# EAGLE design BreadBoard-Power-Supply_v10 (EAGLE 7.5.0)
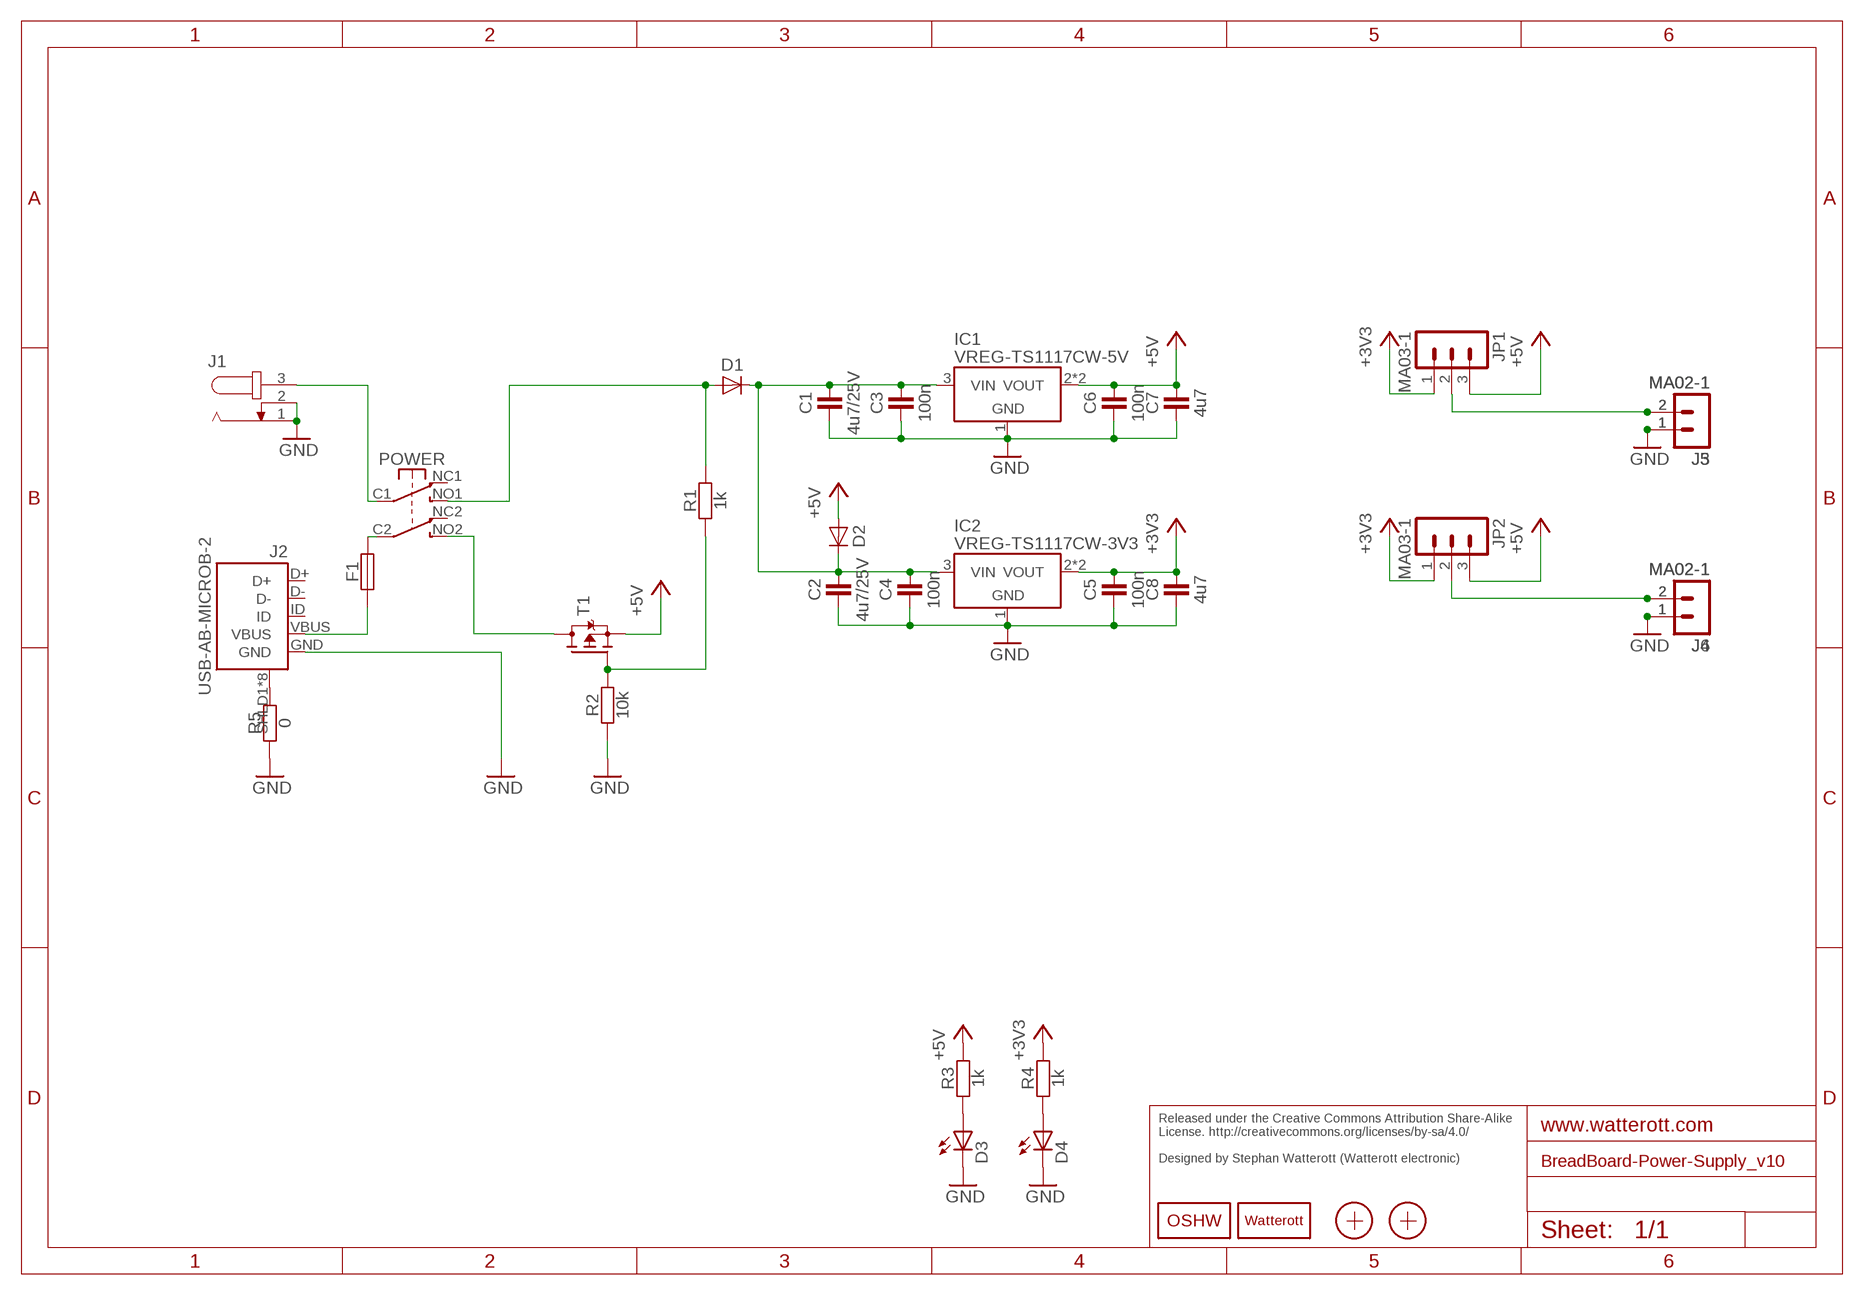
[diagram p0: schematic, sheet 1]

## Parts
C1  4u7/25V  CAPACITOR-1206  [C1206]
C2  4u7/25V  CAPACITOR-1206  [C1206]
C3  100n  CAPACITOR-0402  [C0402]
C4  100n  CAPACITOR-0402  [C0402]
C5  100n  CAPACITOR-0402  [C0402]
C6  100n  CAPACITOR-0402  [C0402]
C7  4u7  CAPACITOR-0402  [C0402]
C8  4u7  CAPACITOR-0402  [C0402]
D1  DIODE-SOD80  [SOD80]
D2  DIODE-SOD80  [SOD80]
D3  LED-0603  [C0603]
D4  LED-0603  [C0603]
F1  FUSE-0805  [C0805]
IC1  VREG-TS1117CW-5V  [SOT223]
IC2  VREG-TS1117CW-3V3  [SOT223]
J1  DC-JACK-2.1  [DC-JACK]
J2  USB-AB-MICROB-2  [USB-MICROB-10118194]
J3  MA02-1  [MA02-1]
J4  MA02-1  [MA02-1]
J5  MA02-1  [MA02-1]
J6  MA02-1  [MA02-1]
JP1  MA03-1  [MA03-1]
JP2  MA03-1  [MA03-1]
LOGO1  OSHW_LOGOX0070  [OSHW_6X70]
LOGO2  LOGO-PLACE  [LOGO_TPLACE]
POWER  SW-2UMGF1260159  [GF1260159]
R1  1k  RESISTOR-0402  [C0402]
R2  10k  RESISTOR-0402  [C0402]
R3  1k  RESISTOR-0402  [C0402]
R4  1k  RESISTOR-0402  [C0402]
R5  0  RESISTOR-0402  [C0402]
T1  MOSFET-P-SOT23  [SOT23]
X1  PASSER-07  [PASSER_07MM]
X2  PASSER-07  [PASSER_07MM]

## Nets
+3V3: C5.2 C8.2 IC2.2(VOUT) IC2.4(VOUT) JP1.1 JP2.1 R4.2
+5V: C6.2 C7.2 D2.A IC1.2(VOUT) IC1.4(VOUT) JP1.3 JP2.3 R3.2 T1.2(S)
GND: C1.1 C2.1 C3.1 C4.1 C5.1 C6.1 C7.1 C8.1 D3.C D4.C IC1.1(GND) IC2.1(GND) J1.1 J1.2 J2.GND J3.1 J4.1 J5.1 J6.1 R2.1 R5.1
N$1: D1.A POWER.NO1(S1) R1.2
N$2: J1.3 POWER.C1(P1)
N$4: R1.1 R2.2 T1.1(G)
N$6: POWER.NO2(S2) T1.3(D)
N$8: D3.A R3.1
N$9: D4.A R4.1
N$10: J3.2 J5.2 JP1.2
N$11: J4.2 J6.2 JP2.2
N$12: F1.2 POWER.C2(P2)
N$15: J2.SHLD1(SHIELD) J2.SHLD2(SHIELD) J2.SHLD3(SHIELD) J2.SHLD4(SHIELD) J2.SHLD5(SHIELD) J2.SHLD6(SHIELD) J2.SHLD7(SHIELD) J2.SHLD8(SHIELD) R5.2
VBUS: F1.1 J2.VBUS
VIN: C1.2 C2.2 C3.2 C4.2 D1.C D2.C IC1.3(VIN) IC2.3(VIN)
Unconnected: J2.D+ J2.D- J2.ID POWER.NC1(O1) POWER.NC2(O2)

## Notes on the sheet
- Released under the Creative Commons Attribution Share-Alike 
  License. http://creativecommons.org/licenses/by-sa/4.0/
  
  Designed by Stephan Watterott (Watterott electronic)

## Library data of the parts
C1-C8 = we-rcl:CAPACITOR: Capacitors ...4.7uF @ 6.3V -> 0402 ...10uF @ 16V -> 0603 ...22uF @ 25V -> 0805
D1 D2 = we-rcl:DIODE: Diodes
D3 D4 = we-opto:LED: LEDs red, green, blue -> 0603
F1 = we-rcl:FUSE: Fuses
IC1 IC2 = we-power:VREG: Voltage Regulators (LDOs, Switching Converters...) LDOs Taiwan Semi TS1117 800mA max 15V - compatible On Semi NCP1117 1A max 20V Taiwan Semi TS9011 250mA max 12V - compatible Diodes AP2210 300mA max 15V Taiwan Semi TS5204 150mA max 16V DC/DC Converter Modules Recom R-78Ex.x-1.0-W36 1A max 28V Murata OKI-78SR-x.x/1.5-W36 1.5A max 36V
J1 = we-con:DC-JACK: DC Jack (2.1mm and 2.5mm)
J2 = we-con:USB-AB: USB Connectors with ID-Pin (5 Pins)
J3-J6 = we-con:MA02-1
JP1 JP2 = we-con:MA03-1: Pin Header
LOGO1 = we-symbol:OSHW_LOGO: Open-Source-Hardware Logo
LOGO2 = we-symbol:LOGO: Watterott electronic Logo
POWER = we-switch:SW-2UM: Switch
R1-R5 = we-rcl:RESISTOR: Resistors all kinds in 0603 and 0402
T1 = we-transistor:MOSFET-P: P-Channel MOSFET (e.g. IRLML6402)
X1 X2 = we-symbol:PASSER: Fiducial Markers

## Board
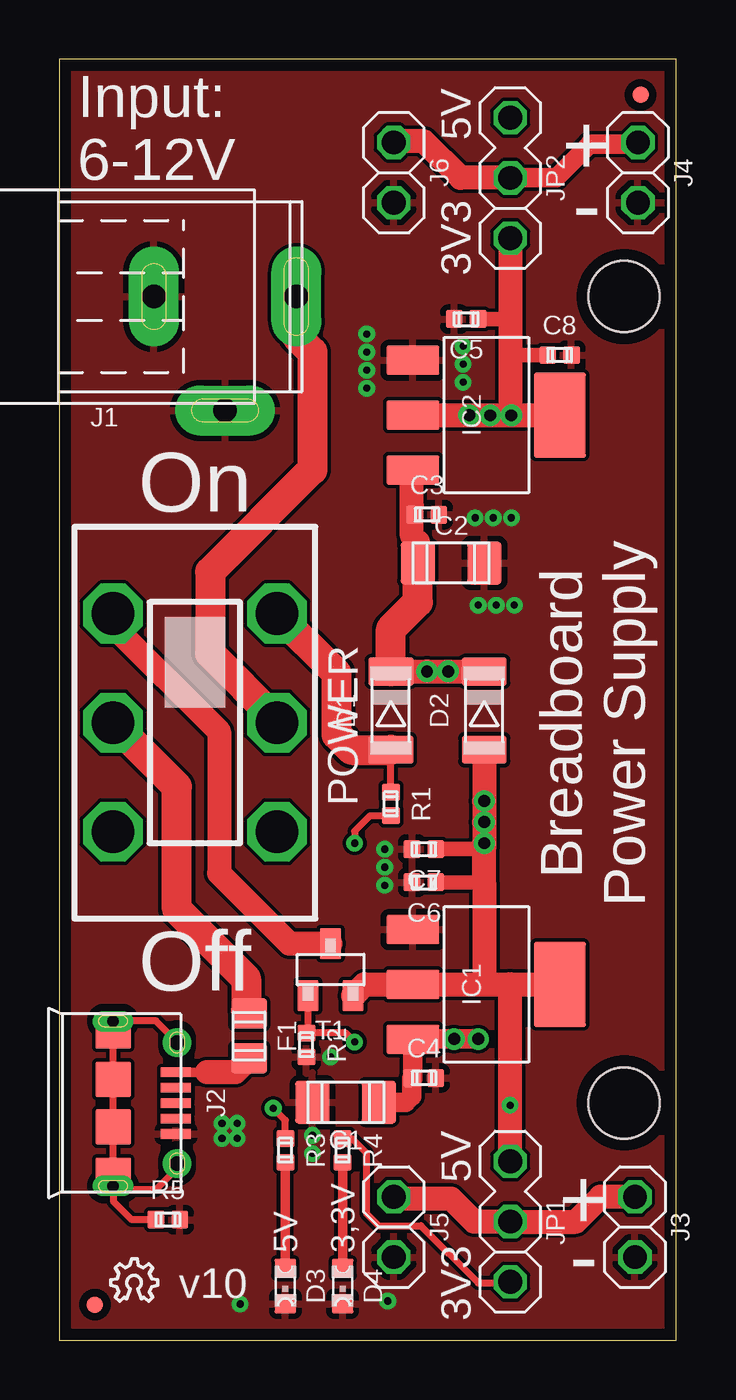
[diagram p1: board, top side]
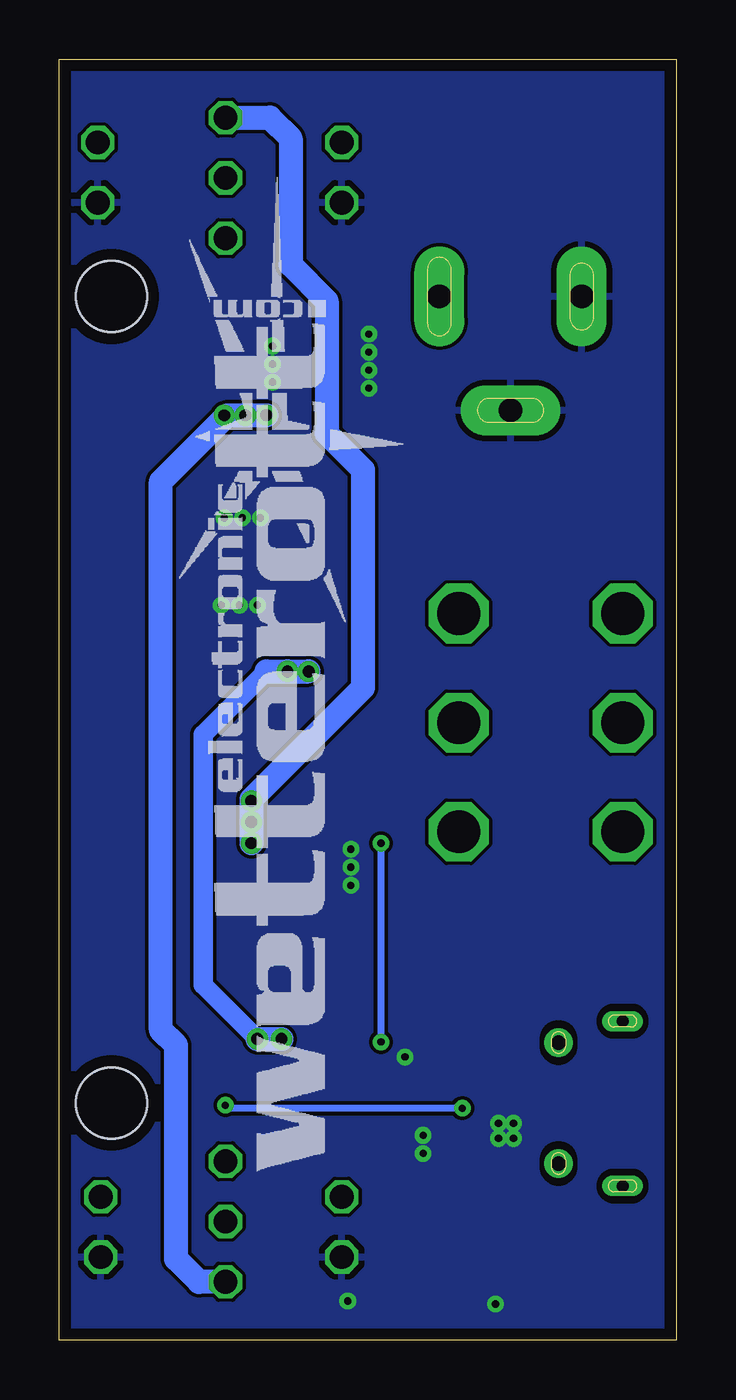
[diagram p2: board, bottom side, seen from below]

Size 26 x 54 mm. Coordinates in mm from the lower left corner, seen from the top.
Outline: 0,0 26,0 26,54 0,54 0,0
Copper layers (1*16): Top 0.035mm / dielectric 1.5mm / Bottom 0.035mm
Design rules "we-dru-2-layer": minimum track width 0.15mm, minimum drill 0.3mm, track to track 0.15mm, track to pad 0.15mm, pad to pad 0.15mm, via to via 0.15mm, smd to smd 0.1mm, copper to edge 0.5mm, drill to drill 0.2mm, minimum pad ring 0.18mm, minimum via ring 0.2mm, stop-mask expansion 0.1mm, vias tented up to drill 0.5mm, thermal gap 0.25mm
Holes 3 mm at 23.8,44 23.8,10

### Footprints (pad centres in the part's own frame; a part is rotated, then mirrored left to right if it is on the bottom)
C1206 = smd 1.8 x 1.45: 1 0,1.4; 2 0,-1.4
C0402 = smd 0.75 x 0.7: 1 0,0.5; 2 0,-0.5
SOD80 = smd 1.9 x 1.2: A 0,-1.65; C 0,1.65
C0603 = smd 0.9 x 0.8: A 0,-0.75; C 0,0.75
C0805 = smd 1.5 x 1.25: 1 0,0.95; 2 0,-0.95
SOT223 = smd 2.235 x 1.219: 1 -3.099,2.311; 2 -3.099,0; 3 -3.099,-2.311 | smd 2.2 x 3.6: 4 3.099,0
DC-JACK = drill 1 pad 2.1 long: 1 3,0; 2 0,4.8; 3 -3,0
USB-MICROB-10118194 = smd 1.3 x 0.4: D+ -2.5,0; D- -2.5,-0.65; GND -2.5,1.3; ID -2.5,0.65; VBUS -2.5,-1.3 | drill 0.6 pad 1.2: SHLD1 -2.55,2.55; SHLD2 -2.55,-2.55 | drill 0.5 pad 0.8 long: SHLD3 0.15,3.5; SHLD4 0.15,-3.45 | smd 1.5 x 1.1: SHLD5 0.15,2.85; SHLD6 0.15,-2.85 | smd 1.5 x 1.5: SHLD7 0.15,1; SHLD8 0.15,-1
MA02-1 = drill 1 octagon: 1 0,1.27; 2 0,-1.27
MA03-1 = drill 1 octagon: 1 0,2.54; 2 0,0; 3 0,-2.54
GF1260159 = drill 1.8 octagon: C1 -3.455,0; C2 3.455,0; NC1 -3.455,4.6; NC2 3.455,4.6; NO1 -3.455,-4.6; NO2 3.455,-4.6
SOT23 = smd 1.3 x 0.9: 1 -1.1,0.95; 2 -1.1,-0.95; 3 1.1,0
PASSER_07MM = smd 0.7 x 0.7: X 0,0

### Placement (x,y rotation side)
C1  12.06,10.03 90 top
C2  16.51,32.77 270 top
C3  15.49,34.8 270 top
C4  15.37,11.05 270 top
C5  17.14,43.05 90 top
C6  15.37,19.3 90 top
C7  15.37,20.7 90 top
C8  21.08,41.53 270 top
D1  13.97,26.54 0 top
D2  17.91,26.54 0 top
D3  9.53,2.29 180 top
D4  11.94,2.29 180 top
F1  8,12.83 180 top
IC1  18,15 0 top
IC2  18,39 0 top
J1  6.99,44 180 top
J2  2.41,10 180 top
J3  24.26,4.78 180 top
J4  24.38,49.23 180 top
J5  14.1,4.78 180 top
J6  14.1,49.23 180 top
JP1  19,5 180 top
JP2  19,49 180 top
LOGO1  2.16,1.65 0 top
LOGO2  11.18,6.86 90 bottom
POWER  5.71,26.04 180 top
R1  13.97,22.61 180 top
R2  10.41,12.45 180 top
R3  9.53,8 180 top
R4  11.94,8 180 top
R5  4.57,5.08 270 top
T1  11.43,15.62 90 top
X1  1.5,1.5 0 top
X2  24.5,52.5 0 top

### Tracks (layer width: path | path; a pad name or v marks a point on that pad's centre or on a via)
+3V3  (via drill 0.5)
  Top 0.305: R4.2 12.32,8.51 12.95,7.87 12.95,5.33 13.46,4.83 15.24,4.83 17.65,2.41 18.95,2.41 JP1.1
  Top 0.61: C8.2 19.05,41.53 19.05,43.05 19,43.05 C5.2
  Top 1.016: IC2.2 v17.27,39 18.92,39 | 18.92,39 IC2.4 | JP2.1 19,43.05 19,39.08 18.92,39
  Bottom 0.406: v18.16,38.99 v19.05,38.99 18.54,38.99 18.54,39
  Bottom 1.016: JP1.1 20.11,2.46 21.08,3.43 21.08,12.45 21.72,13.08 21.72,36.21 18.92,39 18.54,39 v17.27,39
+5V  (via drill 0.3, 0.5)
  Top 0.305: R3.2 9.53,9.27 v9.02,9.78
  Top 0.61: C6.2 17.91,19.3 | C7.2 17.91,20.7
  Top 1.016: JP1.3 v19,9.91 19,15 | 19,15 IC1.4 | 17.91,15 IC1.2 12.86,15 T1.2 | 17.91,15 19,15 | D2.A v17.91,22.73 v17.91,21.84 v17.91,20.95 17.91,20.7 17.91,19.3 17.91,15
  Bottom 0.305: v9.02,9.78 18.87,9.78 v19,9.91
  Bottom 1.016: v17.91,20.95 v17.91,21.84 v17.91,22.73 17.91,22.8 13.21,27.5 13.21,36.7 14.73,38.23 14.73,43.81 16.26,45.34 16.26,50.67 17.12,51.54 JP2.3
GND  (via drill 0.3)
  other vias: 7.49,9.14 6.86,9.14 6.86,8.51 7.49,8.51 13.72,20.7 13.72,19.94 13.72,19.18 10.67,8.64 10.67,7.87 11.43,11.94 13.84,1.65 7.62,1.52 17.53,34.67 18.29,34.67 19.05,34.67 17.65,30.99 18.41,30.99 19.18,30.99 12.95,42.42 12.95,41.66 12.95,40.89 12.95,40.13 17.02,41.91 17.02,41.15 17.02,40.39
  pour Top: 0,0 26,0 26,54 0,54
  pour Bottom: 0,0 26,0 26,54 0,54
N$1
  Top 0.305: R1.2 D1.A
  Top 1.27: D1.A 12.32,24.89 11.68,25.53 11.68,28.12 POWER.NO1
N$2
  Top 1.016: POWER.C1 9.17,26.14
  Top 1.27: J1.3 9.98,42.34 10.67,41.66 10.67,36.7 6.35,32.38 6.35,28.96 9.17,26.14
N$4  (via drill 0.3)
  Top 0.305: T1.1 10.48,13.01 R2.2 12.07,12.95 v12.45,12.57 | R1.1 13.96,22.1 13.08,22.1 12.45,21.46 v12.45,20.95
  Bottom 0.305: v12.45,20.95 v12.45,12.57
N$6
  Top 1.016: T1.3 9.7,16.72 6.73,19.68 6.73,25.65 2.26,30.12 POWER.NO2
N$8
  Top 0.406: D3.A R3.1
N$9
  Top 0.406: D4.A R4.1
N$10
  Top 1.016: J5.2 14.17,5.97 16.51,5.97 17.48,5 JP1.2 21.76,5 22.81,6.04 J3.2
N$11
  Top 0.813: JP2.2 20.93,49 22.35,50.42 24.31,50.42 J4.2
  Top 1.016: JP2.2 16.91,49 15.37,50.55 14.15,50.55 J6.2
N$12
  Top 1.27: POWER.C2 4.95,23.34 4.95,18.16 7.87,15.24 7.87,13.9 F1.2
N$15
  Top 0.305: J2.SHLD1 4.96,7.25 4.06,6.35 2.41,6.35 J2.SHLD3 | R5.2 3.05,5.08 2.29,5.84 2.29,6.48 J2.SHLD3 | J2.SHLD3 J2.SHLD5 J2.SHLD7 J2.SHLD8 J2.SHLD6 J2.SHLD4 2.27,13.46 4.06,13.46 4.96,12.56 J2.SHLD2
VBUS
  Top 0.406: J2.VBUS 6.22,11.3
  Top 1.016: F1.1 7.43,11.3 6.22,11.3
VIN  (via drill 0.5)
  Top 0.305: C3.2 14.99,35.04 14.86,35.18
  Top 0.813: v17.65,12.7 v16.64,12.7 14.91,12.7 IC1.3 14.9,11.02 C4.2 14.86,10.29 14.61,10.03 C1.2
  Top 1.016: C2.2 15.11,33.66 14.86,33.91 14.86,35.18 14.86,36.65 IC2.3 | D1.C v15.49,28.19 D2.C
  Top 1.27: D1.C 13.97,29.97 15.11,31.11 C2.2
  Bottom 0.813: v17.65,12.7 19.94,14.99 19.94,25.53 17.27,28.19 | v15.49,28.19
  Bottom 1.016: v17.65,12.7 v16.64,12.7 | 17.27,28.19 v16.38,28.19 v15.49,28.19

### Text on the board
tPlace: 5V | + | Input: / 6-12V | - | 3V3 | On | Breadboard / Power Supply | Off | 5V | + | 5V | 3,3V | - | v10 | 3V3
Reference: Silkscreen: 21 tPlace + 22 bPlace